# Altium schematic sheet Papilio_WM.SchDoc
size A3
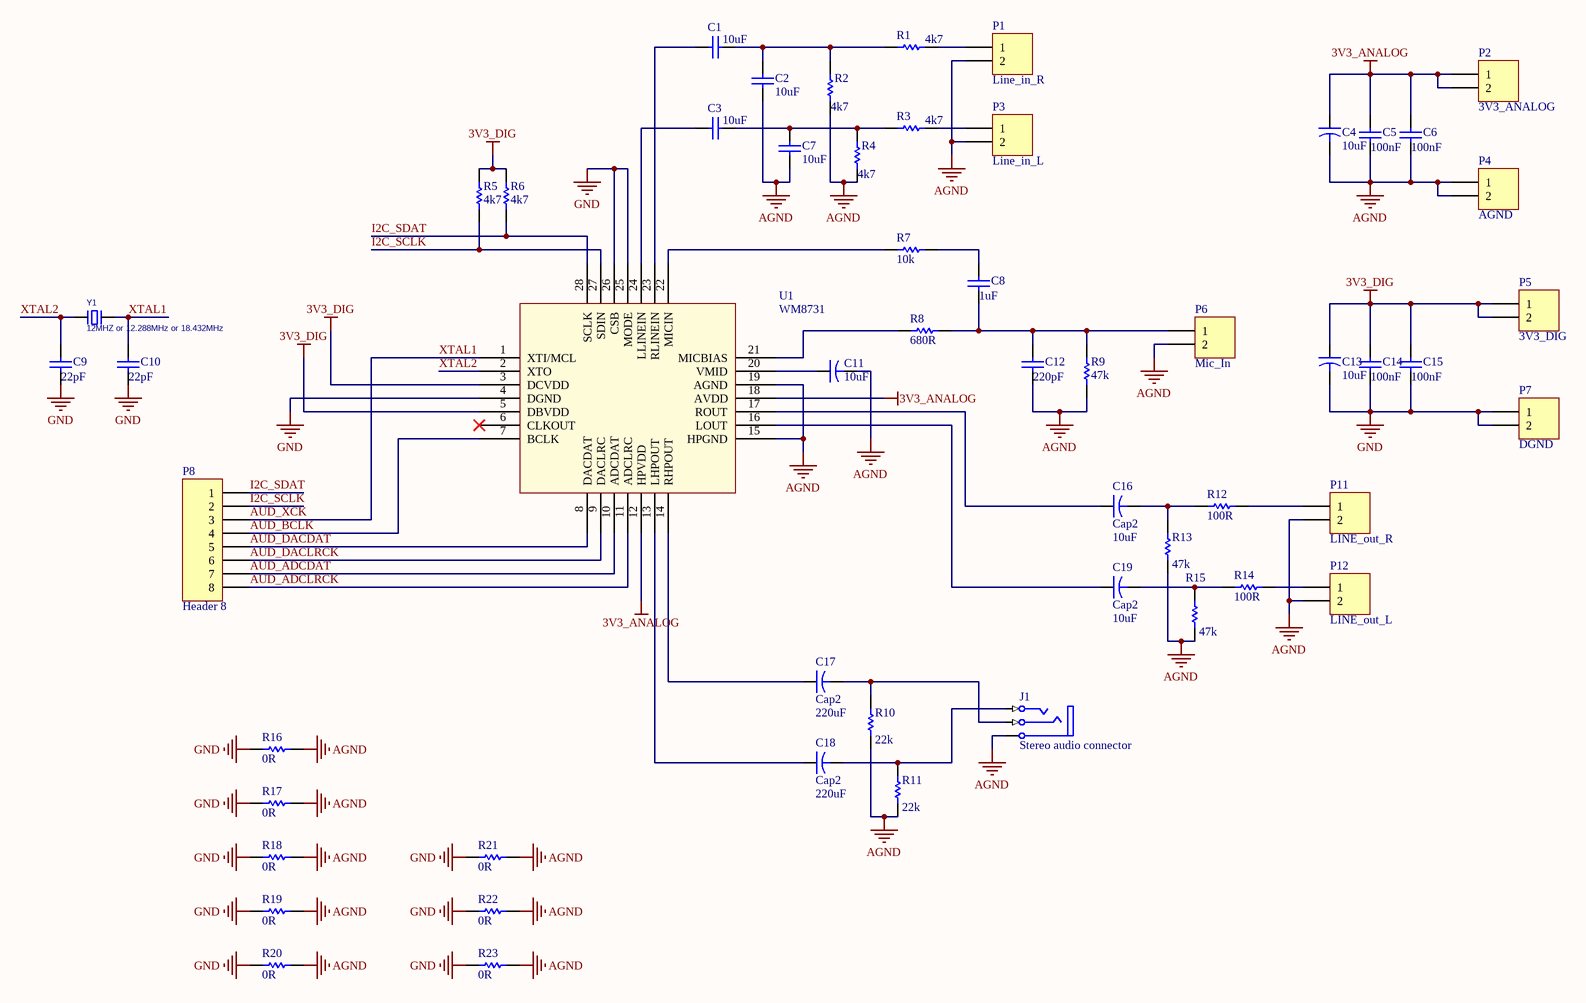
[diagram p0: Papilio_WM.SchDoc]

## Parts
C1  value 10uF  [C0603 - rounded]  (hidden comment: Cap)
C2  value 10uF  [C0603 - rounded]  (hidden comment: Cap)
C3  value 10uF  [C0603 - rounded]  (hidden comment: Cap)
C4  value 10uF  [CAP Eletrolitico 4x5.3 SMD]  (hidden comment: Cap2)
C5  value 100nF  [C0603 - rounded]  (hidden comment: Cap)
C6  value 100nF  [C0603 - rounded]  (hidden comment: Cap)
C7  value 10uF  [C0603 - rounded]  (hidden comment: Cap)
C8  value 1uF  [C0603 - rounded]  (hidden comment: Cap)
C9  value 22pF  [C0603 - rounded]  (hidden comment: Cap)
C10  value 22pF  [C0603 - rounded]  (hidden comment: Cap)
C11  value 10uF  [CAP Eletrolitico 4x5.3 SMD]  (hidden comment: Cap2)
C12  value 220pF  [C0603 - rounded]  (hidden comment: Cap)
C13  value 10uF  [CAP Eletrolitico 4x5.3 SMD]  (hidden comment: Cap2)
C14  value 100nF  [C0603 - rounded]  (hidden comment: Cap)
C15  value 100nF  [C0603 - rounded]  (hidden comment: Cap)
C16  Cap2  value 10uF  [CAP Eletrolitico 4x5.3 SMD]
C17  Cap2  value 220uF  [CAP Eletrolitico 4x5.3 SMD]
C18  Cap2  value 220uF  [CAP Eletrolitico 4x5.3 SMD]
C19  Cap2  value 10uF  [CAP Eletrolitico 4x5.3 SMD]
J1  Stereo audio connector  [Headphone plug]
P1  Line_in_R  [HDR1X2 signed]
P2  3V3_ANALOG  [HDR1X2]
P3  Line_in_L  [HDR1X2 signed]
P4  AGND  [HDR1X2]
P5  3V3_DIG  [HDR1X2]
P6  Mic_In  [HDR1X2 signed]
P7  DGND  [HDR1X2]
P8  Header 8  [HDR1X8]
P11  LINE_out_R  [HDR1X2 signed]
P12  LINE_out_L  [HDR1X2 signed]
R1  value 4k7  [R0603 - rounded]  (hidden comment: Res1)
R2  value 4k7  [R0603 - rounded]  (hidden comment: Res1)
R3  value 4k7  [R0603 - rounded]  (hidden comment: Res1)
R4  value 4k7  [R0603 - rounded]  (hidden comment: Res1)
R5  value 4k7  [R0603 - rounded]  (hidden comment: Res1)
R6  value 4k7  [R0603 - rounded]  (hidden comment: Res1)
R7  value 10k  [R0603 - rounded]  (hidden comment: Res1)
R8  value 680R  [R0603 - rounded]  (hidden comment: Res1)
R9  value 47k  [R0603 - rounded]  (hidden comment: Res1)
R10  value 22k  [R0603 - rounded]  (hidden comment: Res1)
R11  value 22k  [R0603 - rounded]  (hidden comment: Res1)
R12  value 100R  [R0603 - rounded]  (hidden comment: Res1)
R13  value 47k  [R0603 - rounded]  (hidden comment: Res1)
R14  value 100R  [R0603 - rounded]  (hidden comment: Res1)
R15  value 47k  [R0603 - rounded]  (hidden comment: Res1)
R16  value 0R  [R0603 - rounded]  (hidden comment: Res1)
R17  value 0R  [R0603 - rounded]  (hidden comment: Res1)
R18  value 0R  [R0603 - rounded]  (hidden comment: Res1)
R19  value 0R  [R0603 - rounded]  (hidden comment: Res1)
R20  value 0R  [R0603 - rounded]  (hidden comment: Res1)
R21  value 0R  [R0603 - rounded]  (hidden comment: Res1)
R22  value 0R  [R0603 - rounded]  (hidden comment: Res1)
R23  value 0R  [R0603 - rounded]  (hidden comment: Res1)
U1  WM8731  [QFN24]
Y1  12MHZ or 12.288MHz or 18.432MHz  [XTAL]

## Nets
3V3_ANALOG: C4.1 C5.2 C6.2 P2.1 P2.2 U1.12(HPVDD) U1.18(AVDD)
3V3_DIG: C13.1 C14.2 C15.2 P5.1 P5.2 R5.2 R6.2 U1.3(DCVDD) U1.5(DBVDD)
AGND: C2.1 C4.2 C5.1 C6.1 C7.1 C11.2 C12.1 J1.3(S) P1.2 P3.2 P4.1 P4.2 P6.2 P11.2 P12.2 R2.1 R4.1 R9.2 R10.1 R11.1 R13.1 R15.1 R16.1 R17.1 R18.1 R19.1 R20.1 R21.1 R22.1 R23.1 U1.15(HPGND) U1.19(AGND)
GND: C9.1 C10.1 C13.2 C14.1 C15.1 P7.1 P7.2 R16.2 R17.2 R18.2 R19.2 R20.2 R21.2 R22.2 R23.2 U1.4(DGND) U1.25(MODE) U1.26(CSB)
AUD_ADCDAT: P8.7 U1.10(ADCDAT)
AUD_ADCLRCK: P8.8 U1.11(ADCLRC)
AUD_BCLK: P8.4 U1.7(BCLK)
AUD_DACDAT: P8.5 U1.8(DACDAT)
AUD_DACLRCK: P8.6 U1.9(DACLRC)
AUD_XCK: C10.2 P8.3 U1.1(XTI/MCL) Y1.2  [also labelled XTAL1]
I2C_SCLK: P8.2 R5.1 U1.27(SDIN)
I2C_SDAT: P8.1 R6.1 U1.28(SCLK)
XTAL2: C9.2 U1.2(XTO) Y1.1
NetC1_1: C1.1 U1.23(RLINEIN)
NetC1_2: C1.2 C2.2 R1.2 R2.2
NetC3_1: C3.1 U1.24(LLINEIN)
NetC3_2: C3.2 C7.2 R3.2 R4.2
NetC8_1: C8.1 C12.2 P6.1 R8.1 R9.1
NetC8_2: C8.2 R7.1
NetC11_1: C11.1 U1.20(VMID)
NetC16_1: C16.1 U1.17(ROUT)
NetC16_2: C16.2 R12.2 R13.2
NetC17_1: C17.1 U1.14(RHPOUT)
NetC17_2: C17.2 J1.5(R) R10.2
NetC18_1: C18.1 U1.13(LHPOUT)
NetC18_2: C18.2 J1.1(T) R11.2
NetC19_1: C19.1 U1.16(LOUT)
NetC19_2: C19.2 R14.2 R15.2
NetP1_1: P1.1 R1.1
NetP3_1: P3.1 R3.1
NetP11_1: P11.1 R12.1
NetP12_1: P12.1 R14.1
NetR7_2: R7.2 U1.22(MICIN)
NetR8_2: R8.2 U1.21(MICBIAS)

Not connected (* = marked no-connect by the designer): U1 6(CLKOUT)*

## Notes on the sheet
- Title
- Size:
- Date:
- A3
- Number:
- Time:
- Revision:
- Sheet
- of
- File:

## Library data of the parts
C1-C3 C5-C10 C12 C14 C15 = Cap: Capacitor; Published: 8-Jun-2000; LatestRevisionDate: 17-Jul-2002; LatestRevisionNote: Re-released for DXP Platform.; PackageReference: RAD-0.3; Publisher: Altium Limited; PackageDescription: Radial Cap, Thru-Hole; 2 Leads; 0.3 in Pin Spacing
C4 C11 C13 C16-C19 = Cap2: Capacitor; Published: 23-Sep-2002; PackageReference: CAPR5-4X5; Publisher: Altium Limited; PackageDescription: Capacitor; 2 Leads
J1 = Phonejack 3
P1-P7 P11 P12 = Header 2: Header, 2-Pin; LatestRevisionDate: 17-Jul-2002; LatestRevisionNote: Re-released for DXP Platform.; Publisher: Altium Limited
P8 = Header 8: Header, 8-Pin; LatestRevisionDate: 17-Jul-2002; LatestRevisionNote: Re-released for DXP Platform.; Publisher: Altium Limited
R1-R23 = Res1: Resistor; Published: 8-Jun-2000; LatestRevisionDate: 17-Jul-2002; LatestRevisionNote: Re-released for DXP Platform.; PackageReference: AXIAL-0.3; Publisher: Altium Limited; PackageDescription: Axial Device, Thru-Hole; 2 Leads; 0.3 in Pin Spacing
U1 = WM8731: Audio CODEC
Y1 = XD-49US-A